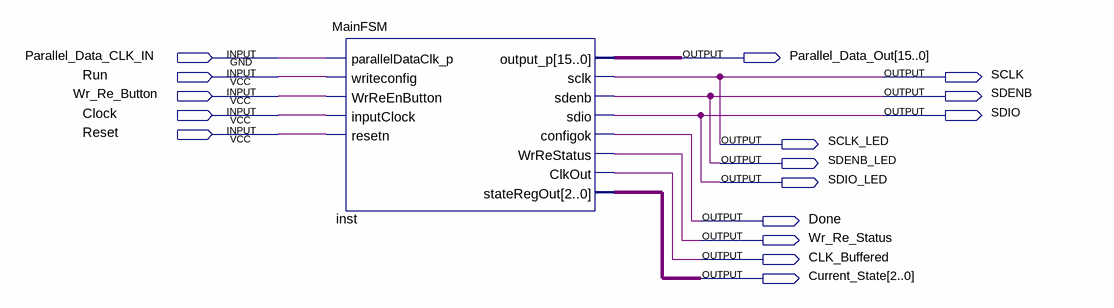
[diagram p0: schematic sheet]
// Quartus schematic HFFrequencySynthesis.bdf as structural Verilog: 1 symbols, 16 pins
module HFFrequencySynthesis (
  input  Parallel_Data_CLK_IN,
  input  Run,
  input  Wr_Re_Button,
  input  Clock,
  input  Reset,
  output [15:0] Parallel_Data_Out,
  output SCLK,
  output SDENB,
  output SDIO,
  output SCLK_LED,
  output SDENB_LED,
  output SDIO_LED,
  output Done,
  output Wr_Re_Status,
  output CLK_Buffered,
  output [2:0] Current_State
);

  MainFSM inst (
    .parallelDataClk_p(Parallel_Data_CLK_IN), .writeconfig(Run), .WrReEnButton(Wr_Re_Button),
    .inputClock(Clock), .resetn(Reset), .output_p(Parallel_Data_Out), .WrReStatus(Wr_Re_Status),
    .ClkOut(CLK_Buffered), .stateRegOut(Current_State), .sclk(SCLK), .sdenb(SDENB), .sdio(SDIO),
    .configok(Done));

  assign SCLK_LED = SCLK;
  assign SDENB_LED = SDENB;
  assign SDIO_LED = SDIO;
endmodule
